# Altium project EFR32xG22_ESL-Node_Ref-Des.PrjPcb
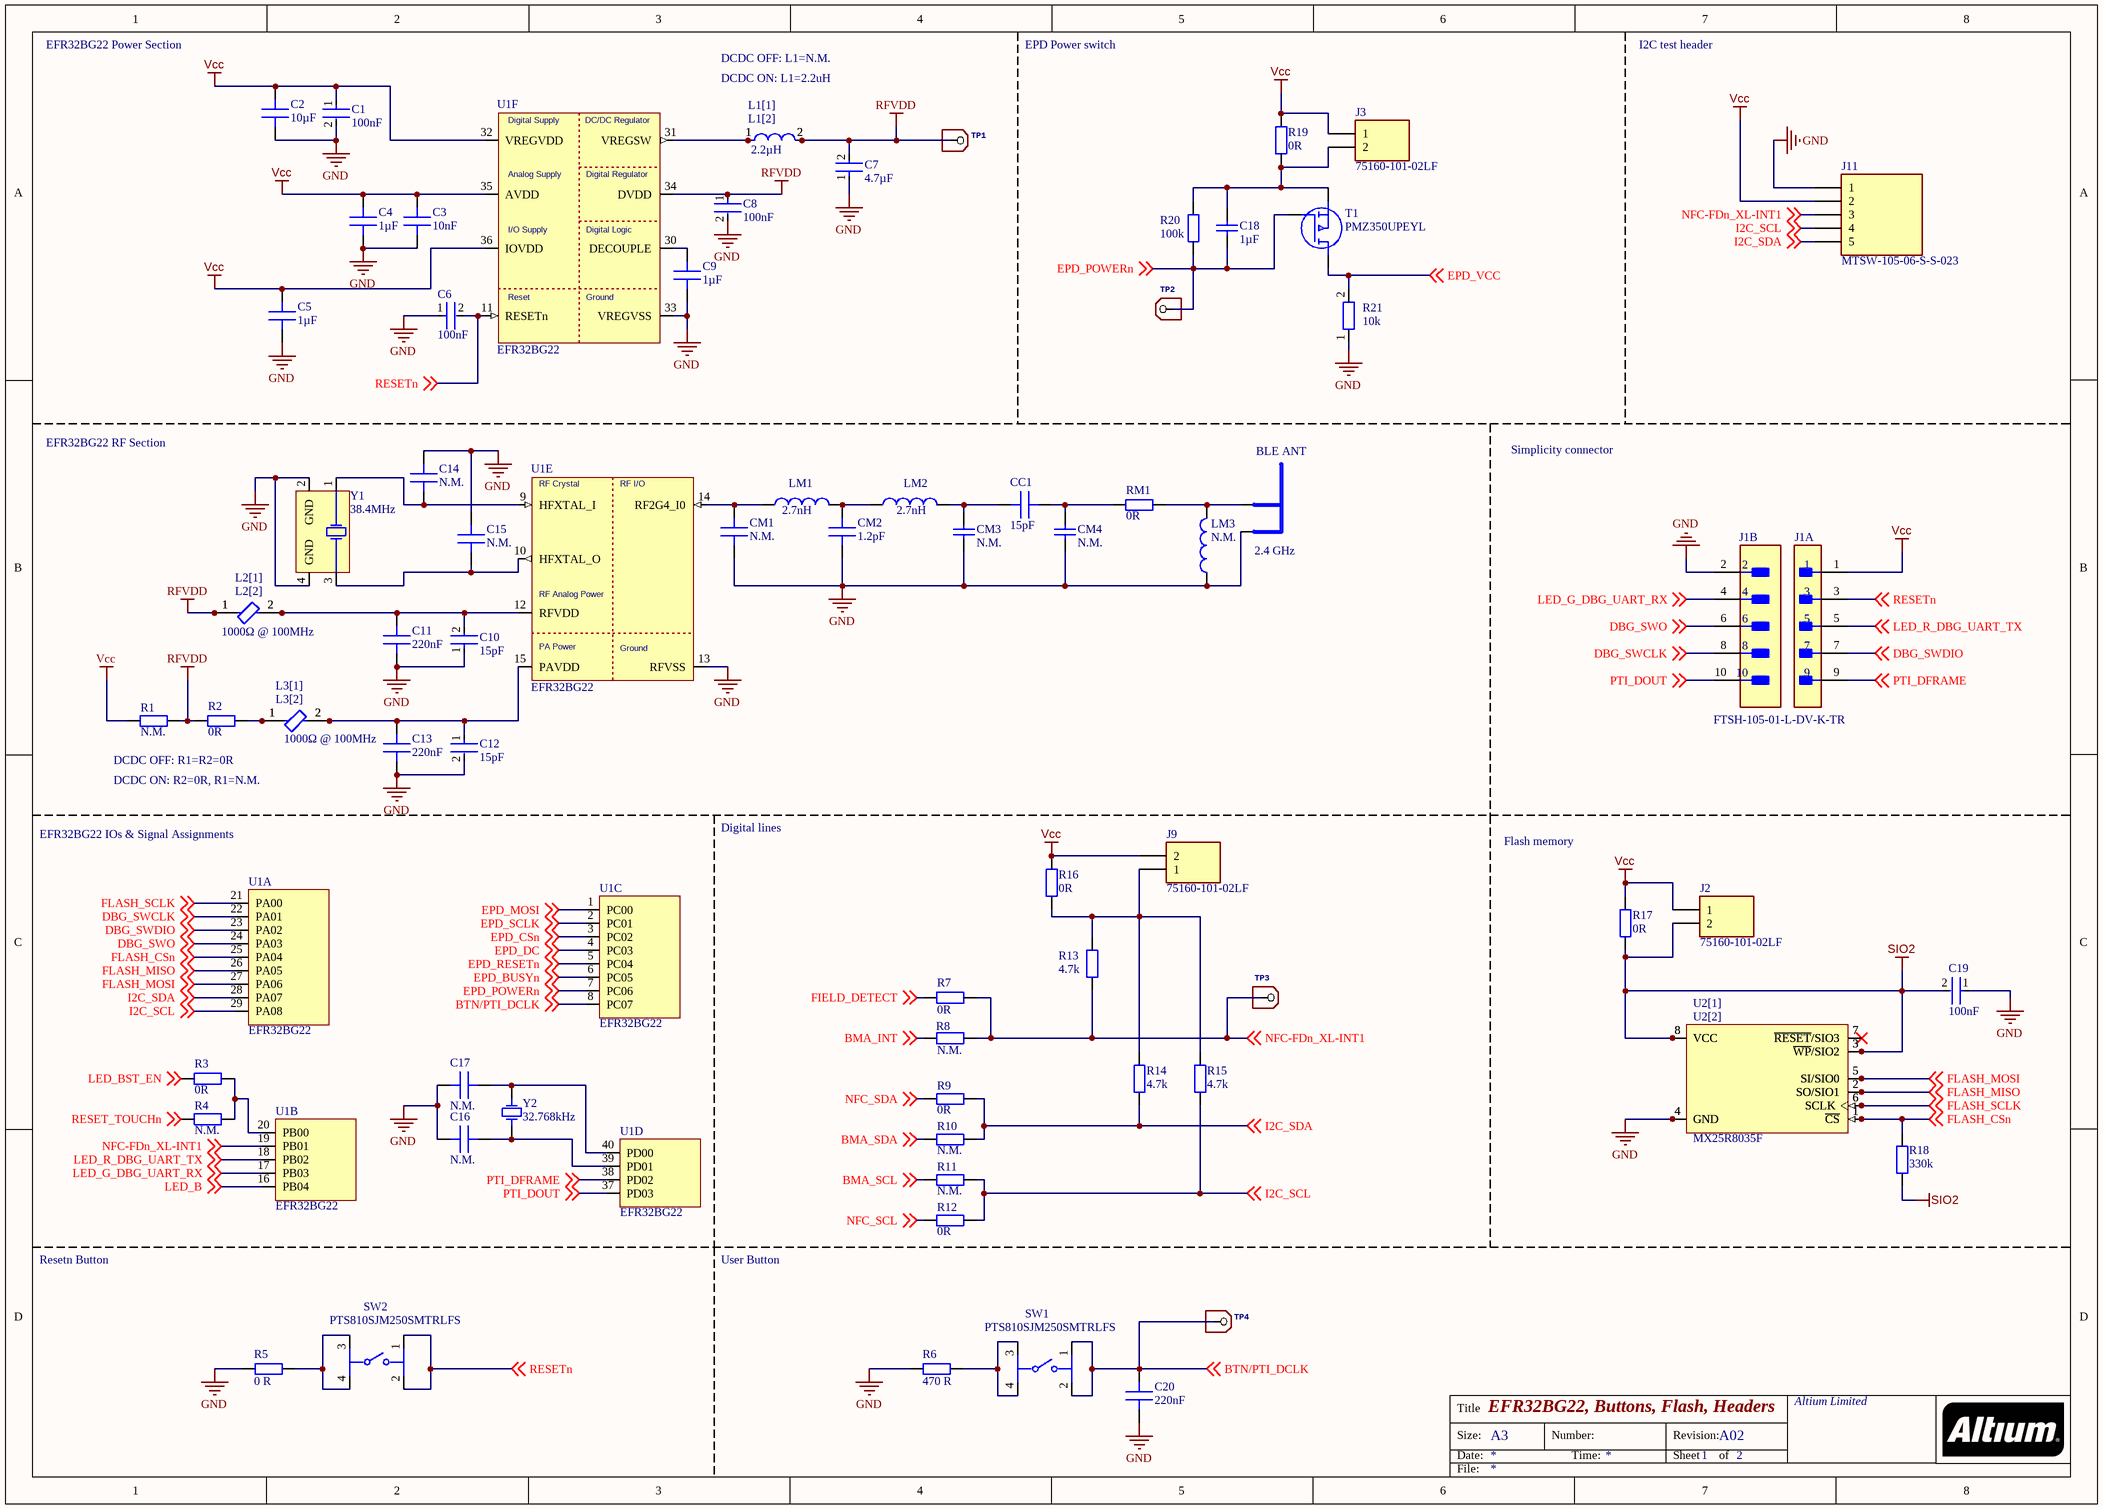
[diagram p0: EFR32xG22_ESL-Node_Ref-Des_Sheet1.SchDoc]
2 sheets, 179 parts. Net scope: global (net labels, ports and power ports of the same name join across sheets).
Board file: EFR32xG22_ESL-Node_Ref-Des.PcbDoc
Sheets:
  EFR32xG22_ESL-Node_Ref-Des_Sheet1.SchDoc
  EFR32xG22_ESL-Node_Ref-Des_Sheet2.SchDoc

## Sheet EFR32xG22_ESL-Node_Ref-Des_Sheet1.SchDoc: EFR32BG22, Buttons, Flash, Headers
size A3; Organization: Altium Limited; Revision: A02; SheetNumber: 1; SheetTotal: 2

### Parts
BLE_ANT  2.4 GHz  [RF_ANTENNA_INVERTED_F]
C1  100nF  [0201]
C2  value 10µF  [0402]  (hidden comment: CAP CER 0402 X5R 10uF 10V 20%)
C3  value 10nF  [0201]  (hidden comment: CAP CER 0201 X7R 10nF 10V 10%)
C4  value 1µF  [0402]  (hidden comment: CAP CER 0402 X7R 1uF 6.3V 10%)
C5  value 1µF  [0201]  (hidden comment: GRM033C81A105ME05D)
C6  100nF  [0201]
C7  4.7µF  [0402]
C8  100nF  [0201]
C9  value 1µF  [0201]  (hidden comment: GRM033C81A105ME05D)
C10  15pF  [0201]
C11  value 220nF  [0201]  (hidden comment: CAP CER 1000PF 10V X7R 0201 10%)
C12  15pF  [0201]
C13  value 220nF  [0201]  (hidden comment: CAP CER 1000PF 10V X7R 0201 10%)
C14  value N.M.  [0201]  (hidden comment: CAP CER 0201 C0G 1.2pF 50V 0.05pF)
C15  value N.M.  [0201]  (hidden comment: CAP CER 0201 C0G 1.2pF 50V 0.05pF)
C16  value N.M.  [0201]  (hidden comment: CAP CER 0201 C0G 1.2pF 50V 0.05pF)
C17  value N.M.  [0201]  (hidden comment: CAP CER 0201 C0G 1.2pF 50V 0.05pF)
C18  1µF  [0402]
C19  100nF  [0201]
C20  value 220nF  [0201]  (hidden comment: CAP CER 1000PF 10V X7R 0201 10%)
CC1  value 15pF  [0201_300ER]  (hidden comment: CAP CER 0201 NP0 18pF 25V 2%)
CM1  value N.M.  [0201_300ER]  (hidden comment: CAP CER 0201 C0G 1.2pF 50V 0.05pF)
CM2  value 1.2pF  [0201_300ER]  (hidden comment: CAP CER 0201 C0G 1.3pF 25V 0.05pF)
CM3  N.M.  [0201_300ER]
CM4  N.M.  [0201_300ER]
J1  FTSH-105-01-L-DV-K-TR  [FTSH_105_01_L_DV_K]  (value not drawn)  (parts A,B of 2)
J2  75160-101-02LF  [Jumper_HDR_2.54mm]
J3  75160-101-02LF  [Jumper_HDR_2.54mm]
J9  75160-101-02LF  [Jumper_HDR_2.54mm]
J11  MTSW-105-06-S-S-023  [Jumper_HDR_2.54mm_5p]
L1[1]  2.2µH  [0805]  (value not drawn)
L1[2]  2.2µH  [0603]
L2[1]  1000Ω @ 100MHz  [0402]
L2[2]  1000Ω @ 100MHz  [0603]  (value not drawn)
L3[1]  1000Ω @ 100MHz  [0402]
L3[2]  1000Ω @ 100MHz  [0603]  (value not drawn)
LM1  value 2.7nH  [0201_300ER]  (hidden comment: LQP03HQ2N6B02)
LM2  value 2.7nH  [0201_300ER]  (hidden comment: IND Fixed 0201 1.5nH 1A 50mOhm 0.05nH)
LM3  value N.M.  [0201_300ER]  (hidden comment: IND Fixed 0201 1.5nH 1A 50mOhm 0.05nH)
R1  N.M.  [0201]
R2  0R  [0201]
R3  0R  [0603]
R4  N.M.  [0603]
R5  value 0 R  [0201]  (hidden comment: RES 0201 100R 1/20W 1% 200ppm)
R6  value 470 R  [0201]  (hidden comment: RES 0201 100R 1/20W 1% 200ppm)
R7  0R  [0402]
R8  N.M.  [0402]
R9  0R  [0402]
R10  N.M.  [0402]
R11  N.M.  [0402]
R12  0R  [0402]
R13  4.7k  [0201]
R14  4.7k  [0201]
R15  4.7k  [0201]
R16  0R  [0603]
R17  0R  [0603]
R18  value 330k  [0201]  (hidden comment: RES 0201 330K 1/20W 1%)
R19  0R  [0603]
R20  100k  [0201]
R21  10k  [0201]
RM1  0R  [0201]
SW1  PTS810SJM250SMTRLFS  [SW_CK_PTS810]
SW2  PTS810SJM250SMTRLFS  [SW_CK_PTS810]
T1  PMZ350UPEYL  [SOT883_B_FIXED]
TP1  TPSMDR1  [TP_RPAD1]  (value not drawn)
TP2  TPSMDR1  [TP_RPAD1]  (value not drawn)
TP3  TPSMDR1  [TP_RPAD1]  (value not drawn)
TP4  TPSMDR1  [TP_RPAD1]  (value not drawn)
U1  value EFR32BG22  [QFN-40_EFR32]  (hidden comment: EFR32XG22)  (parts A,B,C,D,E,F of 6)
U2[1]  value MX25R8035F  [SOP8_127P600X175-8N_150mil]  (hidden comment: MX25R8035FZUIL0)
U2[2]  MX25R8035FZUIL0  [SOP8_127P790X216-8N_200mil]  (value not drawn)
Y1  value 38.4MHz  [XTAL_DSX211SH_4]  (hidden comment: DSX211SH 1ZZNAE38400AB0A)
Y2  value 32.768kHz  [XTAL_DST1610A]  (hidden comment: CM8V-T1A-32.768KHZ-7PF-20PPM-TA-QC)

### Nets
GND: BLE_ANT.2(GND) C1.2 C2.1 C3.2 C4.1 C5.2 C6.1 C7.1 C8.2 C9.1 C10.1 C11.2 C12.2 C13.2 C14.2 C15.2 C16.2 C17.2 C19.1 C20.2 CM1.2 CM2.2 CM3.2 CM4.2 J1.2 J11.1 LM3.1 R5.2 R6.2 R21.1 U1.13(RFVSS) U1.33(VREGVSS) U2[1].4(GND) U2[2].4(GND) Y1.2(GND) Y1.4(GND)
RFVDD: C7.2 C8.1 L1[1].2 L1[2].2 L2[1].1 L2[2].1 R1.1 R2.1 TP1.P$1 U1.34(DVDD)
SIO2: C19.2 J2.2 R17.1 R18.2 U2[1].3(~{WP}/SIO2) U2[1].8(VCC) U2[2].3(~{WP}/SIO2) U2[2].8(VCC)
Vcc: C1.1 C2.2 C3.1 C4.2 C5.1 J1.1 J2.1 J3.1 J9.2 J11.2 R1.2 R16.2 R17.2 R19.2 U1.32(VREGVDD) U1.35(AVDD) U1.36(IOVDD)
BMA_INT: R8.1 ; off-sheet BMA_INT
BMA_SCL: R11.2 ; off-sheet BMA_SCL
BMA_SDA: R10.2 ; off-sheet BMA_SDA
BTN/PTI_DCLK: C20.1 SW1.1 SW1.2 TP4.P$1 U1.8(PC07) ; off-sheet BTN/PTI_DCLK
DBG_SWCLK: J1.8 U1.22(PA01) ; off-sheet DBG_SWCLK
DBG_SWDIO: J1.7 U1.23(PA02) ; off-sheet DBG_SWDIO
DBG_SWO: J1.6 U1.24(PA03) ; off-sheet DBG_SWO
EPD_BUSYn: U1.6(PC05) ; off-sheet EPD_BUSYn
EPD_CSn: U1.3(PC02) ; off-sheet EPD_CSn
EPD_DC: U1.4(PC03) ; off-sheet EPD_DC
EPD_MOSI: U1.1(PC00) ; off-sheet EPD_MOSI
EPD_POWERn: C18.2 R20.1 T1.G TP2.P$1 U1.7(PC06) ; off-sheet EPD_POWERn
EPD_RESETn: U1.5(PC04) ; off-sheet EPD_RESETn
EPD_SCLK: U1.2(PC01) ; off-sheet EPD_SCLK
EPD_VCC: R21.2 T1.D ; off-sheet EPD_VCC
FIELD_DETECT: R7.2 ; off-sheet FIELD_DETECT
FLASH_CSn: R18.1 U1.25(PA04) U2[1].1(~{CS}) U2[2].1(~{CS}) ; off-sheet FLASH_CSn
FLASH_MISO: U1.26(PA05) U2[1].2(SO/SIO1) U2[2].2(SO/SIO1) ; off-sheet FLASH_MISO
FLASH_MOSI: U1.27(PA06) U2[1].5(SI/SIO0) U2[2].5(SI/SIO0) ; off-sheet FLASH_MOSI
FLASH_SCLK: U1.21(PA00) U2[1].6(SCLK) U2[2].6(SCLK) ; off-sheet FLASH_SCLK
I2C_SCL: J11.4 R11.1 R12.1 R15.1 U1.29(PA08) ; off-sheet I2C_SCL
I2C_SDA: J11.5 R9.1 R10.1 R14.1 U1.28(PA07) ; off-sheet I2C_SDA
LED_B: U1.16(PB04) ; off-sheet LED_B
LED_BST_EN: R3.1 ; off-sheet LED_BST_EN
LED_G_DBG_UART_RX: J1.4 U1.17(PB03) ; off-sheet LED_G_DBG_UART_RX
LED_R_DBG_UART_TX: J1.5 U1.18(PB02) ; off-sheet LED_R_DBG_UART_TX
NFC-FDn_XL-INT1: J11.3 R7.1 R8.2 R13.1 TP3.P$1 U1.19(PB01) ; off-sheet NFC-FDn_XL-INT1
NFC_SCL: R12.2 ; off-sheet NFC_SCL
NFC_SDA: R9.2 ; off-sheet NFC_SDA
PTI_DFRAME: J1.9 U1.38(PD02) ; off-sheet PTI_DFRAME
PTI_DOUT: J1.10 U1.37(PD03) ; off-sheet PTI_DOUT
RESET_TOUCHn: R4.2 ; off-sheet RESET_TOUCHn
RESETn: C6.2 J1.3 SW2.1 SW2.2 U1.11(RESETn) ; off-sheet RESETn
NetBLE_ANT_1: BLE_ANT.1(ANT) LM3.2 RM1.2
NetC9_2: C9.2 U1.30(DECOUPLE)
NetC10_2: C10.2 C11.1 L2[1].2 L2[2].2 U1.12(RFVDD)
NetC12_1: C12.1 C13.1 L3[1].2 L3[2].2 U1.15(PAVDD)
NetC14_1: C14.1 U1.9(HFXTAL_I) Y1.1(X1)
NetC15_1: C15.1 U1.10(HFXTAL_O) Y1.3(X2)
NetC16_1: C16.1 U1.39(PD01) Y2.1
NetC17_1: C17.1 U1.40(PD00) Y2.2
NetC18_1: C18.1 J3.2 R19.1 R20.2 T1.S
NetCC1_1: CC1.1 CM3.1 LM2.2
NetCC1_2: CC1.2 CM4.1 RM1.1
NetCM1_1: CM1.1 LM1.1 U1.14(RF2G4_I0)
NetCM2_1: CM2.1 LM1.2 LM2.1
NetJ9_1: J9.1 R13.2 R14.2 R15.2 R16.1
NetL1[1]_1: L1[1].1 L1[2].1 U1.31(VREGSW)
NetL3[1]_1: L3[1].1 L3[2].1 R2.2
NetR3_2: R3.2 R4.1 U1.20(PB00)
NetR5_1: R5.1 SW2.3 SW2.4
NetR6_1: R6.1 SW1.3 SW1.4
NetU2[1]_7: U2[1].7(~{RESET}/SIO3) U2[2].7(~{RESET}/SIO3)

### Notes on the sheet
- EFR32BG22 Power Section
- EPD Power switch
- I2C test header
- DCDC OFF: L1=N.M.
- DCDC ON: L1=2.2uH
- EFR32BG22 RF Section
- Simplicity connector
- DCDC OFF: R1=R2=0R
- DCDC ON: R2=0R, R1=N.M.
- EFR32BG22 IOs & Signal Assignments
- Digital lines
- Flash memory
- Resetn Button
- User Button
- Title
- Size:
- Date:
- A3
- Number:
- Time:
- Revision:
- Sheet
- of
- File:
- (in symbol EFR32XG22, part E) RF Crystal; RF I/O; RF Analog Power; PA Power; Ground
- (in symbol EFR32XG22, part F) Digital Supply; DC/DC Regulator; Analog Supply; Digital Regulator; I/O Supply; Digital Logic; Reset; Ground

### Library data of the parts
BLE_ANT = ANT_INVERTED_F: PCB Footprint: EM358x_INVERTED_F
C1 C6 C8 C19 = CMP-06035-000062-2: Chip Multilayer Ceramic Capacitors for General Purpose, 0201, 0.10uF, X5R, 15%, 10%, 6.3V; Min Operating Temperature: -55°C; Lead Free: Lead Free; Radiation Hardening: No; Dielectric: X5R; Voltage Rating (DC): 6.3V; REACH SVHC: No SVHC; Case/Package: 0201; Voltage Rating: 6.3V; Length: 0.6mm; Max Operating Temperature: 85°C; Width: 0.012inch; Depth: 0.3mm; Material: Ceramic; Case Code (Metric): 0603; Thickness: 0.013inch; Packaging: Tape and Reel; Height: 0.3mm; Capacitance: 100nF; Weight: 6E-06oz; Package Quantity: 1; Mount: Surface Mount; Voltage: 6.3V; Case Code (Imperial): 0201; Tolerance: 10%; Termination: SMD/SMT
C2 = CMP-120-00104-A.01: SubCategory Tag: Ceramic; RoHS: Compliant; Material: X5R; Mount: SMD; Rating: 10V; Package: 0402; Tolerance: 20%; Max Operating Temp: 85°C; Min Operating Temp: -55°C
C3 = CMP-120-00000-A.11: SubCategory Tag: Ceramic; Rating: 10V; Tolerance: 10%; Min Operating Temp: -55°C; RoHS: Compliant; Max Operating Temp: 85°C; Material: X7R; Package: 0201; Mount: SMD
C4 = CMP-120-00029-A.01: SubCategory Tag: Ceramic; Material: X7R; Min Operating Temp: -55°C; Package: 0402; Rating: 6.3V; Mount: SMD; Tolerance: 10%; RoHS: Compliant; Max Operating Temp: 125°C
C5 C9 = CMP-120-00040-A.03: CAP CER 0201 X6S 1uF 10V 20%; Manufacturer: Murata; SubCategory Tag: Ceramic; Min Operating Temp: -55°C; Rating: 10V; Package: 0201; Manufacturer PN: GRM033C81A105ME05D; Max Operating Temp: 105°C; Tolerance: 20%; Material: X6S; Mount: SMD; RoHS: Compliant
C7 = CMP-2008-04549-2: Chip Multilayer Ceramic Capacitors for General Purpose, 0402, 4.7uF, X5R, 15%, 20%, 6.3V; Height: 0.5mm; Weight: 0.000212oz; Length: 1mm; Case Code (Metric): 1005; Packaging: Tape and Reel; Termination: SMD/SMT; Dielectric: X5R; Depth: 0.5mm; Case Code (Imperial): 0402; Min Operating Temperature: -55°C; Case/Package: 0402; Voltage: 6.3V; Width: 0.02inch; Capacitance: 4.7uF; Lead Free: Lead Free; Thickness: 0.022inch; Contact Plating: Tin; REACH SVHC: No SVHC; Package Quantity: 10000; Tolerance: 20%; Voltage Rating (DC): 6.3V; Voltage Rating: 6.3V; Mount: Surface Mount; Max Operating Temperature: 85°C
C10 C12 = CMP-2010-01505-2: Chip Multilayer Ceramic Capacitors for General Purpose, 0201, 15pF, C0G, 30ppm/°C, 5%, 50V; Voltage: 50V; Lead Free: Lead Free; Package Quantity: 1; Length: 0.6mm; Max Operating Temperature: 125°C; Height: 0.3mm; Tolerance: 5%; Termination: SMD/SMT; Case Code (Metric): 0603; Voltage Rating (DC): 50V; Radiation Hardening: No; Mount: Surface Mount; Case Code (Imperial): 0201; Thickness: 0.013inch; Case/Package: 0201; REACH SVHC: No SVHC; Width: 0.012inch; Dielectric: C0G; Min Operating Temperature: -55°C; Packaging: Tape and Reel; Capacitance: 15pF; Depth: 0.3mm; Voltage Rating: 50V
C11 C13 C20 = CMP-120-00038-A.01: SubCategory Tag: Ceramic; Min Operating Temp: -55°C; RoHS: Compliant; Mount: SMD; Rating: 10V; Tolerance: 10%; Package: 0201; Material: X7R; Max Operating Temp: 125°C
C14-C17 CM1 = CMP-120-00031-A.02: SubCategory Tag: Ceramic; Min Operating Temp: -55°C; Package: 0201; Mount: SMD; Max Operating Temp: 125°C; Rating: 50V; RoHS: Compliant; Material: C0G; Tolerance: 0.05pF
C18 = CMP-2000-06336-1: Chip Capacitor, 1 uF, +/- 10%, 10 V, -55 to 85 degC, 0603 (1608 Metric), RoHS, Tape and Reel; Manufacturer: Murata; Dielectric: X5R; Voltage Rating: 10V; Case Height: 0.8mm; Temperature Coefficient / Code: +/-15%; Type: GeneralPurposeMLCC; Brand: MurataElectronics; Capacitance: 1uF; Case Length: 1.6mm; Capacitance - nF: 1000nF; Package Description: 2-Pin Surface Mount Device, Body 1.6 x 0.8 mm; Maximum Operating Temperature: +85C; Minimum Operating Temperature: -55C; Mounting Technology: SurfaceMount; RoHS: Details; Package Reference: 0603; Product: GeneralTypeMLCCs; Packaging: Reel; Case Code - mm: 1608; Manufacturer URL: http://www.murata.com/; Dimensions: 0.8mmWx1.6mmLx0.8mmH; Factory Pack Quantity: 4000; Case Code - in: 0603; Tolerance: 10%; Product Category: MultilayerCeramicCapacitorsMLCC-SMD/SMT; Series: GRM; Datasheet Version: 02/2016; Case Width: 0.8mm; Operating Temperature Range: -55Cto+85C; Datasheet URL: http://search.murata.co.jp/Ceramy/image/img/A01X/G101/ENG/GRM188R61A105KA61-01.pdf; Package / Case: 0603(1608metric); Termination Style: SMD/SMT; Voltage Rating DC: 10V
CC1 = CMP-120-00037-A.02: SubCategory Tag: Ceramic; Mount: SMD; RoHS: Compliant; Tolerance: 2%; Rating: 25V; Min Operating Temp: -55°C; Max Operating Temp: 125°C; Package: 0201; Material: COG
CM2 = CMP-120-00033-A.02: SubCategory Tag: Ceramic; Tolerance: 0.05pF; Material: C0G; Mount: SMD; Max Operating Temp: 125°C; Min Operating Temp: -55°C; Package: 0201; RoHS: Compliant; Rating: 25V
CM3 CM4 = CMP-1033-00061-2: Part Number: 02013A1R5CAT2A; Manufacturer: AVX Interconnect / Elco
J1 = CMP-2000-06293-2: CONN HEADER SMD 10POS 1.27MM; Max Current Rating: 1.75A; Number of Contacts: 10; Gender: Male; Row Spacing: 0.05inch; Connector Type: Male Pin; Housing Color: Black; Min Operating Temperature: -55°C; Depth: 3.43mm; Color: Black; Contact Plating: Gold; REACH SVHC: No SVHC; Packaging: Tape and Reel; Current Rating: 1.75A; Radiation Hardening: No; Package Quantity: 550; Number of Positions: 10; Max Operating Temperature: 125°C; Orientation: Straight; Termination: Solder; Contact Mating Length: 0.12inch; Number of Rows: 2; Lead Free: Lead Free; Contact Material: Bronze; Mount: Surface Mount; Housing Material: Polymer; Pitch: 1.27mm; Length: 6.35mm
J2 J3 J9 = HTSW-102-28-F-S: HEADER, 2.54MM, VERTICAL THOUGH HOLE, 2 POSITION; Connector Systems:Board-to-Board; Pitch Spacing:2.54mm; No. of Rows:1Rows; No. of Contacts:2Contacts; Contact Termination Type:Through Hole; Product Range:HTSW Series; Gender:Header RoHS Compliant: Yes; MP: HTSW10228FS; MF: Samtec; Package: None; Price: None; Purchase-URL: https://pricing.snapeda.com/search/part/HTSW10228FS/?ref=eda; Availability: In Stock; Value: *; Check_prices: https://www.snapeda.com/parts/HTSW10228FS/Samtec/view-part/?ref=eda; SnapEDA_Link: https://www.snapeda.com/parts/HTSW10228FS/Samtec/view-part/?ref=snap
L1[1] L1[2] = CMP-06042-016317-1: Multilayer Type Inductor for Power Lines, 0805 (2012), 2.2μH, 30%, 0.288Ω, 0.8A; Test Frequency: 1MHz; Shielding: Shielded; Current Rating: 800mA; Self Resonant Frequency: 40MHz; Core Material: Ferrite; Inductance: 2.2uH; DC Resistance (DCR): 288mR; RoHS Compliant: Yes; REACH SVHC: No SVHC; Inductance Tolerance: 30%; Package Quantity: 4000; Military Standard: Not; Max Operating Temperature: 125°C; Radiation Hardening: No; Series: LQM; Height - Seated (Max): 0.039inch; Tolerance: 30%; Height: 0.9mm; Lead Free: Lead Free; Case Code (Metric): 2012; Packaging: Tape and Reel; Termination: SMD/SMT; Case Code (Imperial): 0805; Min Operating Temperature: -55°C; Depth: 1.4mm; Mount: Surface Mount; Length: 2mm; DC Current: 800mA; Case/Package: 0805; Max DC Current: 800mA; Width: 0.049inch
L2[1] L2[2] L3[1] L3[2] = CMP-0686-00457-3: Chip Ferrite Bead, 0603, 1000Ω @ 100MHz, 0.5Ω, 25%, 450mA; Number of Circuits: 1; Max DC Current: 400mA; Shielding: Unshielded; DC Resistance (DCR): 500mR; Material: Steel; DC Resistance-Max: 700mR; Impedance: 1kR; Case Code (Imperial): 0603; Max Current Rating: 400mA; Frequency: 100MHz; Min Operating Temperature: -55°C; Case/Package: 0603; Depth: 0.8mm; Lead Free: Lead Free; Core Material: Ferrite; Current Rating: 400mA; Resistance: 500mR; Case Code (Metric): 1608; DC Current: 400mA; Package Quantity: 1; Packaging: Tape and Reel; Width: 0.8mm; Military Standard: Not; Height: 0.8mm; Series: BLM18A; Max Operating Temperature: 125°C; Tolerance: 25%; Termination: SMD/SMT; Test Frequency: 100MHz; Number of Lines: 1; Number of Pins: 2; REACH SVHC: No SVHC; Length: 1.6mm; Radiation Hardening: No
LM1 = CMP-155-00023-A.03: IND FIXED 0201 2.6nH 600mA 0.12Ohm ±0.1nH; Manufacturer: Murata; DC Resistance: 0.12; Shielding: Not shielded; RoHS: Compliant; Tolerance: 0.1nH; SubCategory Tag: Fixed; Manufacturer PN: LQP03HQ2N6B02; Max Operating Temp: 125°C; Rating: 600mA; Package: 0201; Mount: SMD; Min Operating Temp: -55°C
LM2 LM3 = CMP-155-00007-A.02: Shielding: Not shielded; DC Resistance: 50m; Rating: 1A; Tolerance: 0.05nH; Min Operating Temp: -55°C; RoHS: Compliant; Max Operating Temp: 125°C; Package: 0201; Mount: SMD; SubCategory Tag: Fixed
R1-R4 R16 R17 R19 RM1 = CMP-1012-00001-2: Manufacturer: Vishay Dale; Part Number: CRCW06030000Z0EC
R5 R6 = CMP-180-00121-A.01: Rating: 50mW; SubCategory Tag: Thick Film; Package: 0201; Mount: SMD; Min Operating Temp: -55°C; Max Operating Temp: 155°C; RoHS: Compliant; Tolerance: 1%
R7-R12 = CMP-2002-08060-1: Manufacturer: Yageo / Phycomp; Part Number: RC0402JR-130RL
R13-R15 = CMP-1010-00090-1: 4K7 0.05W 5% 0201 (0603 Metric)  SMD; Value: 4700.00 Ohm; Case-Metric: 0603; Technology: SMT; Case-EIA: 0201; Power: 0.05 W; Tolerance: 5 %
R18 = CMP-180-00036-A.02: Rating: 50mW; SubCategory Tag: Thick Film; Mount: SMD; Max Operating Temp: 155°C; Package: 0201; Min Operating Temp: -55°C; RoHS: Compliant; Tolerance: 1%
R20 = CMP-1010-00642-1: 100K 0.05W 1% 0201 (0603 Metric)  SMD; Value: 100000.00 Ohm; Case-Metric: 0603; Technology: SMT; Power: 0.05 W; Case-EIA: 0201; Tolerance: 1 %
R21 = CMP-03412-037826-1: RES SMD 10K OHM 5% 1/20W 0201; Voltage Rating: 25V; Max Power Dissipation: 50mW; Temperature Coefficient: 200ppm/°C; Resistance: 10kR; Min Operating Temperature: -55°C; Packaging: Tape and Reel; Tolerance: 5%; Length: 0.6mm; Contact Plating: Tin; Features: Moisture Resistant; Radiation Hardening: No; Military Standard: Not; Voltage Rating (DC): 25V; Termination: SMD/SMT; Size Code: 0201; Resistance Tolerance: 5%; Case Code (Imperial): 0201; Resistor Type: Thick Film; Depth: 0.3mm; Series: RC; Lead Free: Lead Free; Power Rating: 50mW; Number of Terminations: 2; Case Code (Metric): 0603; RoHS Compliant: Yes; Max Operating Temperature: 125°C; Construction: Rectangular; Case/Package: 0201
SW1 SW2 = CMP-10040-000001-2: SWITCH TACTILE SPST-NO 0.05A 16V; Throw Configuration: SPST; Operating Force: 160gf; Actuator Type: Standard; Switch Travel: 0.15mm; Switch Function: Off-Mom; Max Current Rating: 50mA; Mechanical Life: 150000Cycles; Illumination Type: Non-Illuminated; Package Quantity: 2900; Depth: 4.6mm; Mount: Surface Mount; Packaging: Tape and Reel; Length: 3.2mm; RoHS Compliant: Yes; Case/Package: SMD/SMT; Voltage Rating (DC): 16V; Min Operating Temperature: -40°C; Termination: J-Bend; Lead Free: Lead Free; Contact Plating: Silver; Orientation: Straight; Max Operating Temperature: 85°C; Current Rating: 50mA; Color: Black
T1 = PMZ350UPEYL: P-Channel 20V 1A (Ta) 360mW (Ta), 3.125W (Tc) Surface Mount DFN1006-3; MF: Nexperia USA; Availability: In Stock; Price: None; Package: DFN1006-3-3 Nexperia; MP: PMZ350UPEYL; Value: *; SnapEDA_Link: https://www.snapeda.com/parts/PMZ350UPEYL/Nexperia/view-part/?ref=snap; Check_prices: https://www.snapeda.com/parts/PMZ350UPEYL/Nexperia/view-part/?ref=eda; Purchase-URL: https://pricing.snapeda.com/search/part/PMZ350UPEYL/?ref=eda
TP1-TP4 = TPSMDR1: Testpoint
U1 = EFR32XG22: IC RF SoC 2G4+SUBG 32bit 1024kB FLASH QFN40; Manufacturer: Silicon Labs; SubCategory Tag: Embedded; Voltage: 3.8V; Additional Search Tag: SoC Wireless; Mount: SMD; Min Operating Temp: 125°C; RoHS: Compliant; Max Operating Temp: -40°C; Manufacturer PN: EFR32XG22; Package: QFN40
U2[1] U2[2] = CMP-150-00010-A.07: IC FLASH 8MBIT SPI/QUAD USON; Manufacturer: Macronix; SubCategory Tag: Memory; Voltage: 3.6V; Manufacturer PN: MX25R8035FZUIL0; Package: 8-USON; Additional Search Tag: Flash; RoHS: Compliant; Max Operating Temp: 85°C; Mount: SMD; Min Operating Temp: -40°C
  U2[2]: Value: MX25R8035F
Y1 = XTAL-1-3-4P: CRYSTAL 2.0X1.6mm 38.4MHz 10pF 20ppm; Manufacturer: KDS; SubCategory Tag: XTAL; Tolerance: 20ppm; Max Operating Temp: 105°C; Manufacturer PN: DSX211SH 1ZZNAE38400AB0A; RoHS: Compliant; Package: 2.0X1.6mm; Min Operating Temp: -40°C; Mount: SMD
Y2 = XTAL-2P: CRYSTAL 2.0x1.2mm 32.768kHz 7pF 20ppm; Manufacturer: Micro Crystal; SubCategory Tag: XTAL; RoHS: Compliant; Package: 2.0x1.2mm; Mount: SMD; Tolerance: 20ppm; Max Operating Temp: 85°C; Manufacturer PN: CM8V-T1A-32.768KHZ-7PF-20PPM-TA-QC; Min Operating Temp: -40°C
J11 = MTSW-105-06-S-S-023: Value: *; MP: MTSW-105-06-S-S-023; Availability: Unavailable; Price: None; Design Item ID: MTSW-105-06-S-S-023; Source: MTSW-105-06-S-S-023.SchLib; Package: None

## Sheet EFR32xG22_ESL-Node_Ref-Des_Sheet2.SchDoc: LED, NTAG, EPD, XM, Batteries
size A3; Organization: Altium Limited; Revision: A02; SheetNumber: 2; SheetTotal: 2
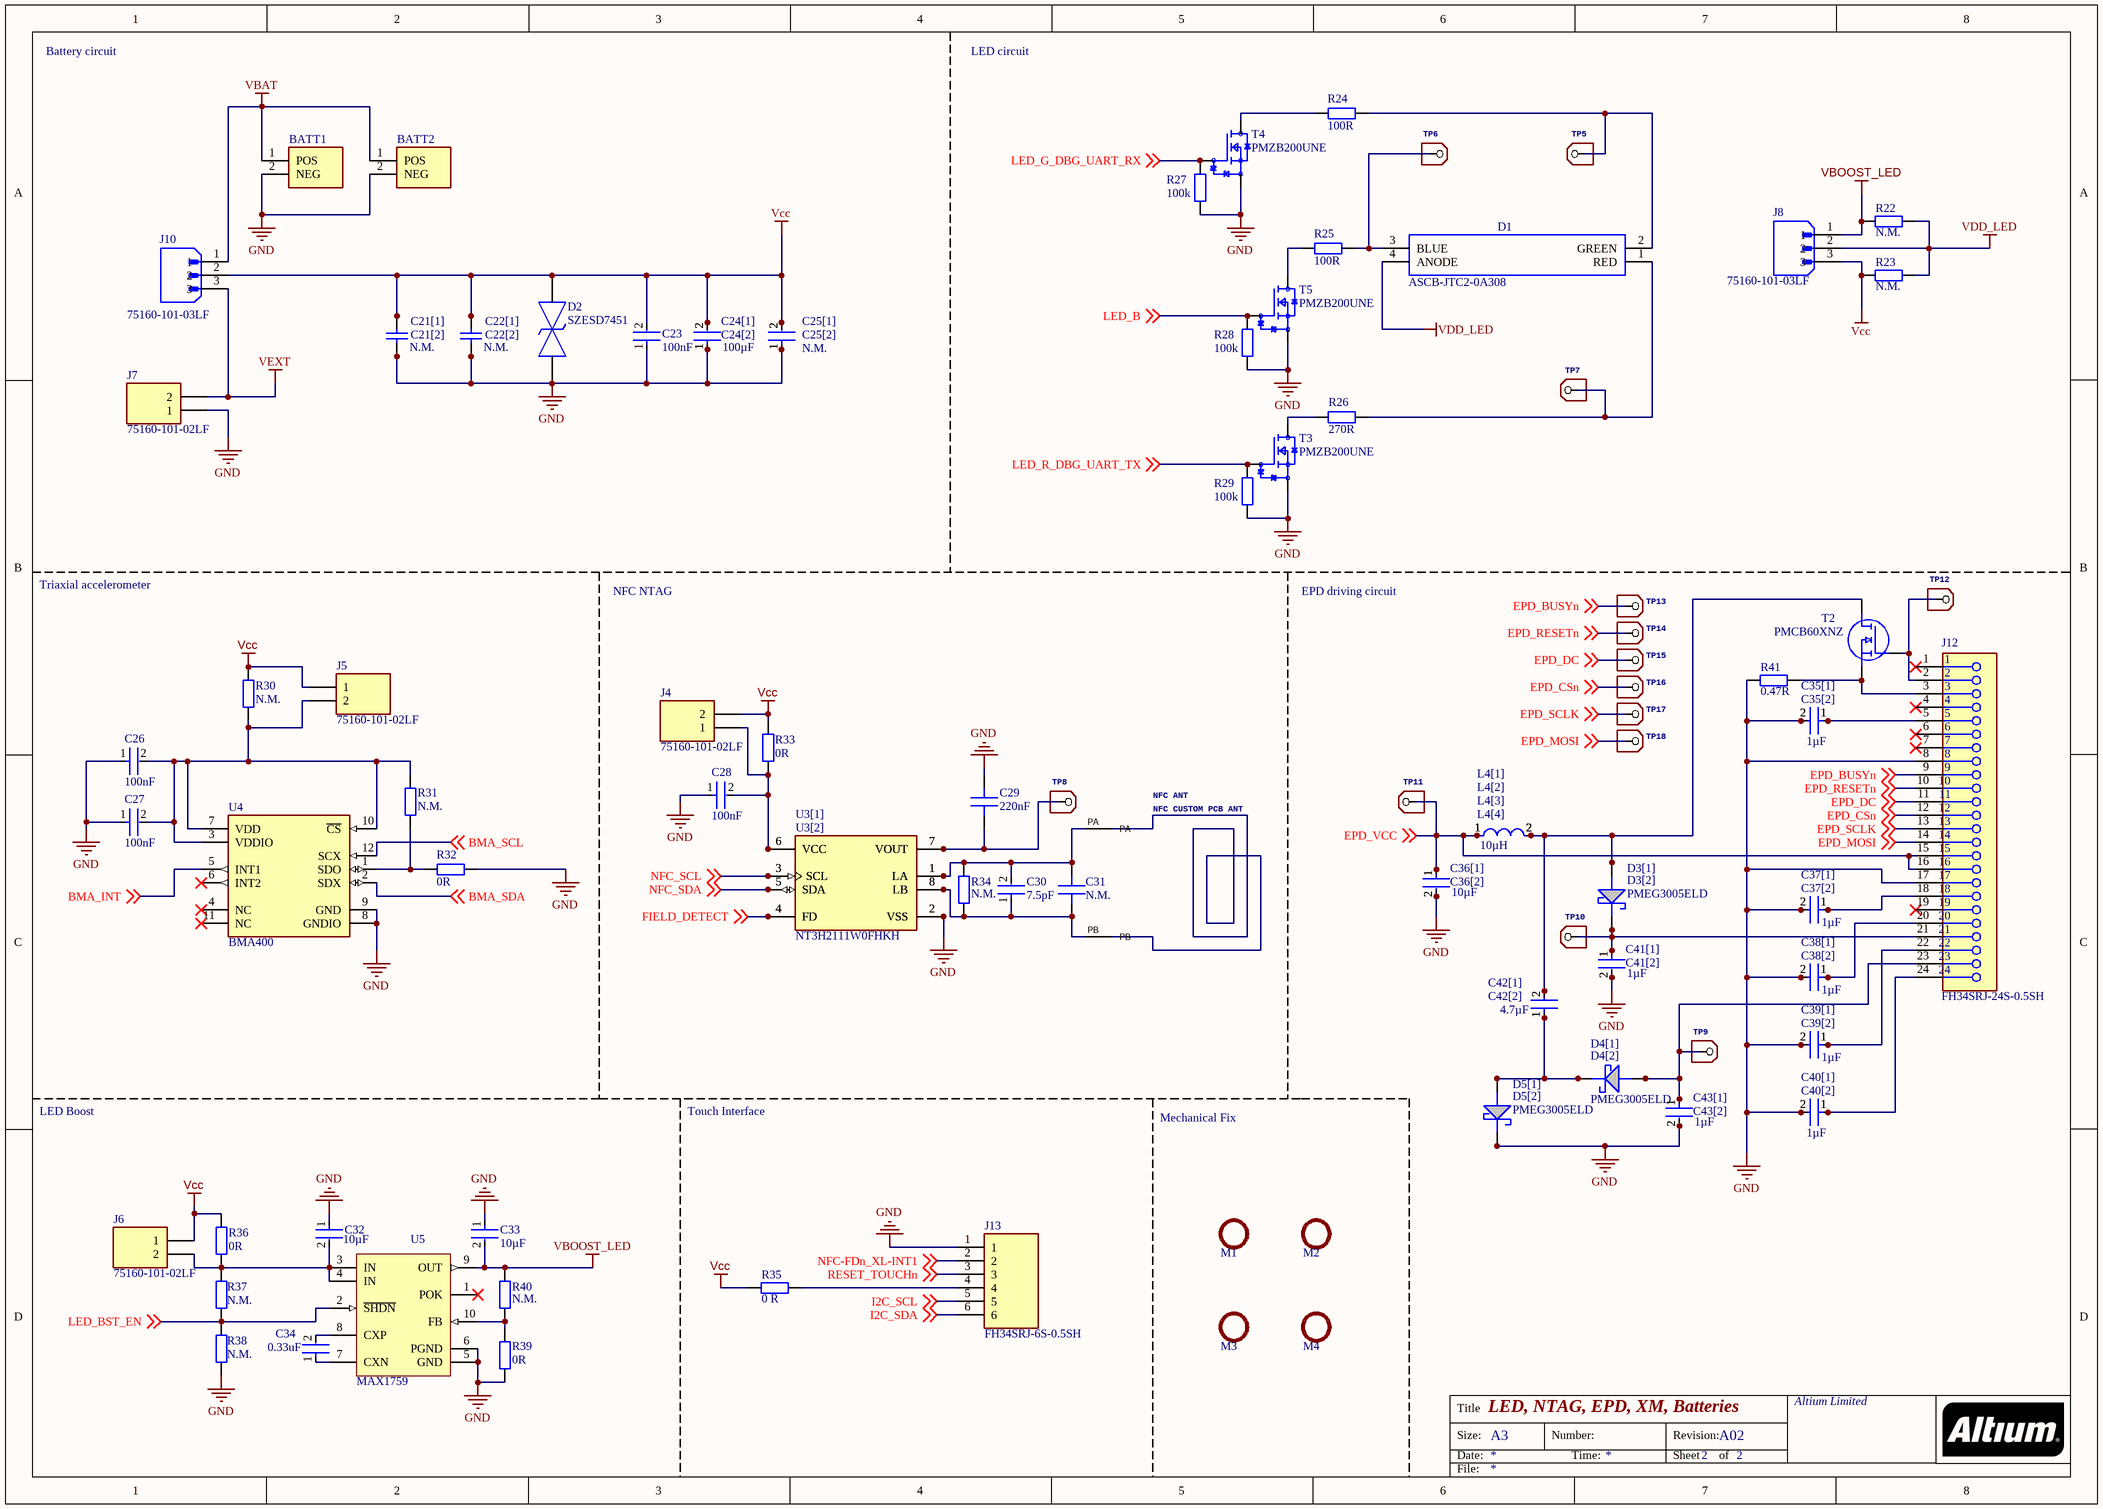
[diagram p1: EFR32xG22_ESL-Node_Ref-Des_Sheet2.SchDoc]

### Parts
BATT1  1052TR  [Battery_holder_CR2450_SMT_1052]  (value not drawn)
BATT2  1052TR  [Battery_holder_CR2450_SMT_1052]  (value not drawn)
C21[1]  N.M.  [1206]
C21[2]  N.M.  [0805]  (value not drawn)
C22[1]  N.M.  [1206]
C22[2]  N.M.  [0805]  (value not drawn)
C23  100nF  [0402]
C24[1]  100µF  [1206]
C24[2]  100µF  [0805]  (value not drawn)
C25[1]  N.M.  [1206]
C25[2]  100µF  [0805]  (value not drawn)
C26  100nF  [0402]
C27  100nF  [0402]
C28  100nF  [0201]
C29  value 220nF  [0201]  (hidden comment: CAP CER 1000PF 10V X7R 0201 10%)
C30  7.5pF  [0201]
C31  value N.M.  [0201]  (hidden comment: CAP CER 0201 C0G 1.2pF 50V 0.05pF)
C32  10µF  [0603]
C33  10µF  [0603]
C34  0.33uF  [0603]
C35[1]  1µF  [0603]
C35[2]  1µF  [0402]  (value not drawn)
C36[1]  10µF  [0603]
C36[2]  10µF  [0402]  (value not drawn)
C37[1]  1µF  [0603]
C37[2]  1µF  [0402]  (value not drawn)
C38[1]  1µF  [0603]
C38[2]  1µF  [0402]  (value not drawn)
C39[1]  1µF  [0603]
C39[2]  1µF  [0402]  (value not drawn)
C40[1]  1µF  [0603]
C40[2]  1µF  [0402]  (value not drawn)
C41[1]  1µF  [0603]
C41[2]  1µF  [0402]  (value not drawn)
C42[1]  4.7µF  [0603]
C42[2]  4.7µF  [0402]  (value not drawn)
C43[1]  1µF  [0603]
C43[2]  1µF  [0402]  (value not drawn)
D1  ASCB-JTC2-0A308  [LED_RGB_PLCC-4]
D2  SZESD7451  [SOD882_NXP]
D3[1]  PMEG3005ELD  [SOD-323]  (value not drawn)
D3[2]  PMEG3005ELD  [SOD882_FIXED]
D4[1]  PMEG3005ELD  [SOD-323]  (value not drawn)
D4[2]  PMEG3005ELD  [SOD882_FIXED]
D5[1]  PMEG3005ELD  [SOD-323]  (value not drawn)
D5[2]  PMEG3005ELD  [SOD882_FIXED]
J4  75160-101-02LF  [Jumper_HDR_2.54mm]
J5  75160-101-02LF  [Jumper_HDR_2.54mm]
J6  75160-101-02LF  [Jumper_HDR_2.54mm]
J7  75160-101-02LF  [Jumper_HDR_2.54mm]
J8  75160-101-03LF  [Jumper_HDR_2.54mm_3p]
J10  75160-101-03LF  [Jumper_HDR_2.54mm_3p]
J12  FH34SRJ-24S-0.5SH  [FPC_CONNECTOR_24_0.5MM_PITCH_BOTTOM_CONTACT_ACES_1.3MM_50530]
J13  FH34SRJ-6S-0.5SH  [FH34SRJ-6S-0.5SH]
L4[1]  10µH  [0805]  (value not drawn)
L4[2]  10µH  [0806]  (value not drawn)
L4[3]  10µH  [2520]  (value not drawn)
L4[4]  10µH  [WE-MAPI-3015]
M1  HOLE_2.2_NPL  [HOLE_2.2_NPL]  (value not drawn)
M2  HOLE_2.2_NPL  [HOLE_2.2_NPL]  (value not drawn)
M3  HOLE_2.2_NPL  [HOLE_2.2_NPL]  (value not drawn)
M4  HOLE_2.2_NPL  [HOLE_2.2_NPL]  (value not drawn)
NFC_ANT  NFC CUSTOM PCB ANT  [NFC_27X14.3_7W_WIDTH0.25MM_SPACE0.2MM_1.5UH_V1_0_NOVIASTOP]
R22  N.M.  [0603]
R23  N.M.  [0603]
R24  value 100R  [0201]  (hidden comment: RES 0201 100R 1/20W 1% 200ppm)
R25  value 100R  [0201]  (hidden comment: RES 0201 100R 1/20W 1% 200ppm)
R26  270R  [0201]
R27  100k  [0201]
R28  100k  [0201]
R29  100k  [0201]
R30  N.M.  [0603]
R31  value N.M.  [0201]  (hidden comment: RES 0201 0R)
R32  value 0R  [0201]  (hidden comment: RES 0201 0R)
R33  0R  [0603]
R34  value N.M.  [0201]  (hidden comment: RES 0201 0R)
R35  0 R  [0603]
R36  0R  [0603]
R37  N.M.  [0603]
R38  N.M.  [0603]
R39  value 0R  [0201]  (hidden comment: RES 0201 0R)
R40  value N.M.  [0201]  (hidden comment: RES 0201 0R)
R41  0.47R  [0402]
T2  PMCB60XNZ  [SOT8026]
T3  PMZB200UNE  [SOT883_B_FIXED]
T4  PMZB200UNE  [SOT883_B_FIXED]
T5  PMZB200UNE  [SOT883_B_FIXED]
TP5  TPSMDR1  [TP_RPAD1]  (value not drawn)
TP6  TPSMDR1  [TP_RPAD1]  (value not drawn)
TP7  TPSMDR1  [TP_RPAD1]  (value not drawn)
TP8  TPSMDR1  [TP_RPAD1]  (value not drawn)
TP9  TPSMDR1  [TP_RPAD1]  (value not drawn)
TP10  TPSMDR1  [TP_RPAD1]  (value not drawn)
TP11  TPSMDR1  [TP_RPAD1]  (value not drawn)
TP12  TPSMDR1  [TP_RPAD1]  (value not drawn)
TP13  TPSMDR1  [TP_RPAD1]  (value not drawn)
TP14  TPSMDR1  [TP_RPAD1]  (value not drawn)
TP15  TPSMDR1  [TP_RPAD1]  (value not drawn)
TP16  TPSMDR1  [TP_RPAD1]  (value not drawn)
TP17  TPSMDR1  [TP_RPAD1]  (value not drawn)
TP18  TPSMDR1  [TP_RPAD1]  (value not drawn)
U3[1]  NT3H2111W0FHKH  [SO8_SOIC127P600X175-8N]  (value not drawn)
U3[2]  NT3H2111W0FHKH  [XQFN-8]
U4  BMA400  [BMA400]
U5  MAX1759  [UMAX10]

### Nets
GND: BATT1.2(NEG) BATT2.2(NEG) C21[1].1 C21[2].1 C22[1].1 C22[2].1 C23.1 C24[1].1 C24[2].1 C25[1].1 C25[2].1 C26.1 C27.1 C28.1 C29.1 C32.1 C33.1 C35[1].2 C35[2].2 C36[1].2 C36[2].2 C37[1].2 C37[2].2 C38[1].2 C38[2].2 C39[1].2 C39[2].2 C40[1].2 C40[2].2 C41[1].2 C41[2].2 C43[1].2 C43[2].2 D2.A D5[1].C D5[2].C J7.1 J12.8 J12.17 J13.1 R27.1 R28.1 R29.1 R32.1 R38.1 R39.1 R41.2 T3.S T4.S T5.S U3[1].2(VSS) U3[2].2(VSS) U4.8(GNDIO) U4.9(GND) U5.5(GND) U5.6(PGND)
VBAT: BATT1.1(POS) BATT2.1(POS) J10.1
VBOOST_LED: C33.2 J8.1 R22.2 R40.2 U5.9(OUT)
Vcc: C21[1].2 C21[2].2 C22[1].2 C22[2].2 C23.2 C24[1].2 C24[2].2 C25[1].2 C25[2].2 D2.C J4.2 J5.1 J6.1 J8.3 J10.2 R23.2 R30.2 R33.2 R35.2 R36.2
VDD_LED: D1.4(ANODE) J8.2 R22.1 R23.1
VEXT: J7.2 J10.3
BMA_INT: U4.5(INT1) ; off-sheet BMA_INT
BMA_SCL: U4.12(SCX) ; off-sheet BMA_SCL
BMA_SDA: U4.2(SDX) ; off-sheet BMA_SDA
EPD_BUSYn: J12.9 TP13.P$1 ; off-sheet EPD_BUSYn
EPD_CSn: J12.12 TP16.P$1 ; off-sheet EPD_CSn
EPD_DC: J12.11 TP15.P$1 ; off-sheet EPD_DC
EPD_MOSI: J12.14 TP18.P$1 ; off-sheet EPD_MOSI
EPD_RESETn: J12.10 TP14.P$1 ; off-sheet EPD_RESETn
EPD_SCLK: J12.13 TP17.P$1 ; off-sheet EPD_SCLK
EPD_VCC: C36[1].1 C36[2].1 J12.15 J12.16 L4[1].1 L4[2].1 L4[3].1 L4[4].1 TP11.P$1 ; off-sheet EPD_VCC
FIELD_DETECT: U3[1].4(FD) U3[2].4(FD) ; off-sheet FIELD_DETECT
I2C_SCL: J13.5 ; off-sheet I2C_SCL
I2C_SDA: J13.6 ; off-sheet I2C_SDA
LED_B: R28.2 T5.G ; off-sheet LED_B
LED_BST_EN: R37.1 R38.2 U5.2(~{SHDN}) ; off-sheet LED_BST_EN
LED_G_DBG_UART_RX: R27.2 T4.G ; off-sheet LED_G_DBG_UART_RX
LED_R_DBG_UART_TX: R29.2 T3.G ; off-sheet LED_R_DBG_UART_TX
NFC-FDn_XL-INT1: J13.2 ; off-sheet NFC-FDn_XL-INT1
NFC_SCL: U3[1].3(SCL) U3[2].3(SCL) ; off-sheet NFC_SCL
NFC_SDA: U3[1].5(SDA) U3[2].5(SDA) ; off-sheet NFC_SDA
RESET_TOUCHn: J13.3 ; off-sheet RESET_TOUCHn
NetC26_2: C26.2 C27.2 J5.2 R30.1 R31.1 U4.3(VDDIO) U4.7(VDD) U4.10(~{CS})
NetC28_2: C28.2 J4.1 R33.1 U3[1].6(VCC) U3[2].6(VCC)
NetC29_2: C29.2 TP8.P$1 U3[1].7(VOUT) U3[2].7(VOUT)
NetC30_1: C30.1 C31.1 NFC_ANT.PB R34.1 U3[1].8(LB) U3[2].8(LB)
NetC30_2: C30.2 C31.2 NFC_ANT.PA R34.2 U3[1].1(LA) U3[2].1(LA)
NetC32_2: C32.2 J6.2 R36.1 R37.2 U5.3(IN) U5.4(IN)
NetC34_1: C34.1 U5.7(CXN)
NetC34_2: C34.2 U5.8(CXP)
NetC35[1]_1: C35[1].1 C35[2].1 J12.5
NetC37[1]_1: C37[1].1 C37[2].1 J12.18
NetC38[1]_1: C38[1].1 C38[2].1 J12.20
NetC39[1]_1: C39[1].1 C39[2].1 J12.22
NetC40[1]_1: C40[1].1 C40[2].1 J12.24
NetC41[1]_1: C41[1].1 C41[2].1 D3[1].C D3[2].C J12.21 TP10.P$1
NetC42[1]_1: C42[1].1 C42[2].1 D4[1].C D4[2].C D5[1].A D5[2].A
NetC42[1]_2: C42[1].2 C42[2].2 D3[1].A D3[2].A L4[1].2 L4[2].2 L4[3].2 L4[4].2 T2.D
NetC43[1]_1: C43[1].1 C43[2].1 D4[1].A D4[2].A J12.23 TP9.P$1
NetD1_1: D1.1(RED) R26.2 TP7.P$1
NetD1_2: D1.2(GREEN) R24.2 TP5.P$1
NetD1_3: D1.3(BLUE) R25.2 TP6.P$1
NetJ12_2: J12.2 T2.G TP12.P$1
NetJ12_3: J12.3 R41.1 T2.S
NetJ13_4: J13.4 R35.1
NetR24_1: R24.1 T4.D
NetR25_1: R25.1 T5.D
NetR26_1: R26.1 T3.D
NetR31_2: R31.2 R32.2 U4.1(SDO)
NetR39_2: R39.2 R40.1 U5.10(FB)

Not connected (* = marked no-connect by the designer): J12 1* 4* 6* 7* 19*; M1 0; M2 0; M3 0; M4 0; U4 4(NC)* 6(INT2)* 11(NC)*; U5 1(POK)*

### Notes on the sheet
- Battery circuit
- LED circuit
- Triaxial accelerometer
- NFC NTAG
- EPD driving circuit
- LED Boost
- Touch Interface
- Mechanical Fix
- Title
- Size:
- Date:
- A3
- Number:
- Time:
- Revision:
- Sheet
- of
- File:

### Library data of the parts
BATT1 BATT2 = 1052TR: Battery Holder _Open_ Coin, 24.5mm 1 Cell SMD _SMT_ Tab; MF: Keystone Electronics; Availability: Unavailable; SnapEDA_Link: https://www.snapeda.com/parts/1052TR/Keystone%20Electronics/view-part/3611881/?ref=snap; MP: 1052TR; Price: None; Package: None; Value: *
C21[1] C22[1] = CMP-1662-00011-2: Chip Capacitor, 100 uF, +/- 20%, 6.3 V, -55 to 85 degC, 1206 (3216 Metric), RoHS, Tape and Reel; PartNumber: GRM31CR60J107ME39L; Capacitance: 100 uF; Voltage Rating (DC): 6.3 V; Type (Capacitors): X5R; REACH SVHC: No SVHC; Height: 1.6 mm; Tolerance: 20%; Packaging: Tape and Reel; Mount: Surface Mount; PackageDescription: 2-Pin Surface Mount Device, Body 3.2 x 1.6 mm; ComponentLink1URL: http://www.murata.com/; Case\/Package: 1206; Pins: 2; ComponentLink2Description: Datasheet; PackageReference: 1206; Width: 1.6 mm; Package Quantity: 2000; Min Operating Temperature: -55 degC; Case Code (Imperial): 1206; Max Operating Temperature: 85 degC; DatasheetVersion: 09/2016; Mounting Technology: Surface Mount; Voltage Rating: 6.3 V; ComponentLink1Description: Manufacturer URL; Radiation Hardening: No; Case Code (Metric): 3216; Length: 3.2 mm; ComponentLink2URL: http://psearch.en.murata.com/capacitor/product/GRM31CR60J107ME39%23.pdf; RoHSCompliant: true
C21[2] C22[2] = CMP-1662-00011-2: Chip Capacitor, 100 uF, +/- 20%, 6.3 V, -55 to 85 degC, 1206 (3216 Metric), RoHS, Tape and Reel; PartNumber: GRM31CR60J107ME39L; Case\/Package: 1206; Capacitance: 100 uF; Voltage Rating (DC): 6.3 V; Type (Capacitors): X5R; REACH SVHC: No SVHC; Height: 1.6 mm; Tolerance: 20%; Packaging: Tape and Reel; Mount: Surface Mount; PackageDescription: 2-Pin Surface Mount Device, Body 3.2 x 1.6 mm; ComponentLink1URL: http://www.murata.com/; Pins: 2; ComponentLink2Description: Datasheet; PackageReference: 1206; Width: 1.6 mm; Package Quantity: 2000; Min Operating Temperature: -55 degC; Case Code (Imperial): 1206; Max Operating Temperature: 85 degC; DatasheetVersion: 09/2016; Mounting Technology: Surface Mount; Voltage Rating: 6.3 V; ComponentLink1Description: Manufacturer URL; Radiation Hardening: No; Case Code (Metric): 3216; Length: 3.2 mm; ComponentLink2URL: http://psearch.en.murata.com/capacitor/product/GRM31CR60J107ME39%23.pdf; RoHSCompliant: true
C23 C26 C27 = CMP-2008-03712-2: Ceramic Capacitor for Automotive 100nF ±10% 16VDC X7R 0402 Paper T/R; Voltage Rating: 16V; Height: 0.5mm; Width: 0.5mm; Packaging: Tape and Reel; Case Code (Imperial): 0402; Package Quantity: 1; Radiation Hardening: No; Voltage Rating (DC): 16V; Capacitance: 100nF; Tolerance: 10%; Thickness: 0.022inch; Max Operating Temperature: 125°C; Depth: 0.5mm; Ratings: AEC-Q200; Termination: SMD/SMT; Case Code (Metric): 1005; Min Operating Temperature: -55°C; Dielectric: X7R; Length: 1mm; Case/Package: 0402; Lead Free: Lead Free; Mount: Surface Mount
C24[1] C24[2] C25[1] C25[2] = CMP-06035-063005-1: CAP CER 100UF 6.3V X5R 1206; Tolerance: 20%; Case Code (Metric): 3216; Width: 0.063inch; Packaging: Tape and Reel; Lead Free: Lead Free; Capacitance: 100uF; Package Quantity: 1; Construction: Flat; Max Operating Temperature: 85°C; Voltage Rating (DC): 6.3V; Min Operating Temperature: -55°C; Case Code (Imperial): 1206; RoHS Compliant: Yes; Voltage: 6.3V; Mount: Surface Mount; Thickness: 0.071inch; Height: 1.6mm; Series: GRM; REACH SVHC: No SVHC; Length: 3.2mm; Voltage Rating: 6.3V; Radiation Hardening: No; Dielectric: X5R; Case/Package: 1206; Depth: 1.6mm; Termination: SMD/SMT
C28 = CMP-2010-01264-2: Chip Multilayer Ceramic Capacitors for General Purpose, 0201, 0.10uF, X5R, 15%, 10%, 10V; Mount: Surface Mount; Dielectric: X5R; Width: 0.012inch; Tolerance: 10%; Radiation Hardening: No; Voltage Rating: 10V; REACH SVHC: No SVHC; Height: 0.3mm; Max Operating Temperature: 85°C; Voltage Rating (DC): 10V; Capacitance: 100nF; Thickness: 0.013inch; Termination: SMD/SMT; Lead Free: Lead Free; Package Quantity: 1; Case/Package: 0201; Min Operating Temperature: -55°C; Weight: 6E-06oz; Length: 0.6mm; Case Code (Imperial): 0201; Depth: 0.3mm; Voltage: 10V; Packaging: Tape and Reel; Case Code (Metric): 0603
C29 = CMP-120-00038-A.01: SubCategory Tag: Ceramic; Min Operating Temp: -55°C; RoHS: Compliant; Mount: SMD; Rating: 10V; Tolerance: 10%; Package: 0201; Material: X7R; Max Operating Temp: 125°C
C30 = CMP-2010-01602-2: Chip Multilayer Ceramic Capacitors for General Purpose, 0201, 7.5pF, C0G, 30ppm/°C, 0.1pF, 50V; Mount: Surface Mount; Case/Package: 0201; Case Code (Imperial): 0201; Min Operating Temperature: -55°C; Packaging: Tape and Reel; Package Quantity: 15000; Termination: SMD/SMT; Height: 0.3mm; Width: 0.012inch; Length: 0.024inch; Voltage Rating (DC): 50V; Max Operating Temperature: 125°C; Voltage Rating: 50V; Dielectric: C0G; Capacitance: 7.5pF; Case Code (Metric): 0603; Thickness: 0.013inch
C31 = CMP-120-00031-A.02: SubCategory Tag: Ceramic; Min Operating Temp: -55°C; Package: 0201; Mount: SMD; Max Operating Temp: 125°C; Rating: 50V; RoHS: Compliant; Material: C0G; Tolerance: 0.05pF
C32 C33 = CMP-2006-02520-2: Chip Multilayer Ceramic Capacitors for General Purpose, 0603, 10uF, X5R, 15%, 20%, 25V; Tolerance: 20%; Resistor Type: Ceramic; Voltage: 25V; Max Operating Temperature: 85°C; Min Operating Temperature: -55°C; Capacitance: 10uF; Dielectric: X5R; Lead Free: Lead Free; REACH SVHC: No SVHC; Case/Package: 0603; Mount: Surface Mount; Voltage Rating (DC): 25V; Height: 0.8mm; Length: 1.6mm; Thickness: 0.031inch; Width: 0.031inch; Termination: SMD/SMT; Case Code (Imperial): 0603; Case Code (Metric): 1608; Package Quantity: 1; Packaging: Tape and Reel; Depth: 0.8mm; Voltage Rating: 25V; Weight: 0.000222oz; Number of Pins: 2
C34 = CMP-2006-02359-2: Ceramic Capacitor for Automotive 330nF  ±10% 16VDC X7R 0603 Paper T/R; Voltage Rating (DC): 16V; Package Quantity: 1; Case Code (Metric): 1608; Height: 0.8mm; Min Operating Temperature: -55°C; Length: 1.6mm; Case Code (Imperial): 0603; Max Operating Temperature: 125°C; Thickness: 0.035inch; Dielectric: X7R; Voltage Rating: 16V; Tolerance: 10%; Lead Free: Lead Free; Mount: Surface Mount; Depth: 0.8mm; Width: 0.031inch; Ratings: AEC-Q200; Packaging: Tape and Reel; Case/Package: 0603; Radiation Hardening: No; Capacitance: 330nF; Termination: SMD/SMT
C35[1] C35[2] C37[1] C37[2] C38[1] C38[2] C39[1] C39[2] C40[1] C40[2] = CMP-2006-02363-3: Ceramic Capacitor for Automotive 1uF  ±10% 25VDC X7R 0603 Paper T/R; Voltage Rating: 25V; Min Operating Temperature: -55°C; Ratings: AEC-Q200; Case Code (Imperial): 0603; Length: 1.6mm; REACH SVHC: No SVHC; Mount: Surface Mount; Width: 0.031inch; Package Quantity: 4000; Radiation Hardening: No; Lead Free: Lead Free; Dielectric: X7R; Thickness: 0.035inch; Weight: 0.000222oz; Tolerance: 10%; Case Code (Metric): 1608; Voltage Rating (DC): 25V; Case/Package: 0603; Voltage: 25V; Max Operating Temperature: 125°C; Termination: SMD/SMT; Depth: 0.8mm; Height: 0.8mm; Packaging: Tape and Reel; Capacitance: 1uF
C36[1] C36[2] C41[1] C41[2] C42[1] C42[2] C43[1] C43[2] = CMP-2000-05448-2: CAP CER 10UF 10V X5R 0603; Manufacturer Part Number: GRM188R61A106KE69D; Manufacturer: Murata; Temperature Coefficient: 15%; Material: Ceramic; Tolerance: 10%; Device Class L1: Passive Components; ComponentLink2Description: Datasheet; Height: 0.95mm; Package: GRM18-0.15; Octopart: https://octopart.com/grm188r61a106ke69d-murata-22851381; Value: 10uF; Digikey Description: CAP CER 10UF 10V X5R 0603; Temperature Range High: +85°C; Temperature Range Low: -55°C; Temperature Characteristic: X5R; Capacitance: 10uF; RoHS: TRUE; Device Class L2: Capacitors; ComponentLink2URL: https://search.murata.co.jp/Ceramy/image/img/A01X/G101/ENG/GRM188R61A106KE69-01A.pdf; Device Class L3: Ceramic Capacitors; Lead Free: Yes; Mouser Description: Multilayer Ceramic Capacitors MLCC - SMD/SMT 0603 10uF 10volts X5R + - 10%; Category: Cap; Voltage Rating: 10V; Temperature: -55°C to +85°C; Automotive: No
D1 = ASCB-JTC2-0A308: Standard LEDs - SMD 1615 Tricolor PLCC-4 LED; Manufacturer_Name: Avago Technologies; Geometry.Height: 1.2mm; Mouser Part Number: 630-ASCB-JTC2-0A308; Mouser Price/Stock: https://www.mouser.co.uk/ProductDetail/Broadcom-Avago/ASCB-JTC2-0A308?qs=TuK3vfAjtkWp7J8ieqn2Tw%3D%3D; Manufacturer_Part_Number: ASCB-JTC2-0A308; Datasheet Link: https://docs.broadcom.com/doc/ASCB-JTC2-0A308-1615-Tricolor-PLCC-4-LED-DS
D2 = ESD7551N2T5G: ESD Suppressors / TVS Diodes BI-DIRECTIONAL 5V ESD PR; Manufacturer_Name: onsemi; Geometry.Height: 0.4mm; Manufacturer_Part_Number: ESD7551N2T5G; Mouser Part Number: 863-ESD7551N2T5G; Mouser Price/Stock: https://www.mouser.co.uk/ProductDetail/onsemi/ESD7551N2T5G?qs=5aG0NVq1C4x8NutXGbtG6w%3D%3D; Arrow Part Number: ESD7551N2T5G; Arrow Price/Stock: https://www.arrow.com/en/products/esd7551n2t5g/on-semiconductor; Mouser Testing Part Number: *; Mouser Testing Price/Stock: *; Datasheet Link: http://www.onsemi.com/pub/Collateral/ESD7551-D.PDF
D3[1] D3[2] D4[1] D4[2] D5[1] D5[2] = PMEG3005ELD_315: Schottky Diodes & Rectifiers Schottky Diode; Manufacturer_Name: Nexperia; Manufacturer_Part_Number: PMEG3005ELD,315; Geometry.Height: 0.4mm; Mouser Part Number: 771-PMEG3005ELD315; Mouser Price/Stock: https://www.mouser.co.uk/ProductDetail/Nexperia/PMEG3005ELD315?qs=j56XEm5BXrSQr1dGtOQTNA%3D%3D; Arrow Part Number: PMEG3005ELD,315; Arrow Price/Stock: https://www.arrow.com/en/products/pmeg3005eld315/nexperia?region=nac; Mouser Testing Part Number: *; Mouser Testing Price/Stock: *; Datasheet Link: https://assets.nexperia.com/documents/data-sheet/PMEG3005ELD.pdf
J4-J7 = HTSW-102-28-F-S: as J2 on sheet EFR32xG22_ESL-Node_Ref-Des_Sheet1; Package: None; Price: None; Purchase-URL: https://pricing.snapeda.com/search/part/HTSW10228FS/?ref=eda; Availability: In Stock; Value: *; Check_prices: https://www.snapeda.com/parts/HTSW10228FS/Samtec/view-part/?ref=eda; SnapEDA_Link: https://www.snapeda.com/parts/HTSW10228FS/Samtec/view-part/?ref=snap
J8 J10 = 75160-101-03LF: BergStikÂ®, Board to Board connector, Unshrouded vertical header, through hole, single Row,3 position, 2.54mm pitch; MF: Amphenol ICC (FCI); SnapEDA_Link: https://www.snapeda.com/parts/75160-101-03LF/Amphenol+FCI/view-part/?ref=snap; Availability: In Stock; Purchase-URL: https://pricing.snapeda.com/search/part/75160-101-03LF/?ref=eda; Check_prices: https://www.snapeda.com/parts/75160-101-03LF/Amphenol+FCI/view-part/?ref=eda; Value: *; Package: None; MP: 75160-101-03LF; Price: None
J12 = CMP-11609-000022-1: CONN FPC/FFC 24POS .5MM; Number of Positions: 24; Actuator Material: Nylon; Voltage Rating: 50V; Pitch: 0.02inch; Current Rating: 500mA; Contact Plating: Gold; Packaging: Tape and Reel; RoHS Compliant: Yes; Contact Material: Bronze; Min Operating Temperature: -55°C; Max Operating Temperature: 85°C; Number of Pins: 24; Housing Material: Polymer; Termination: Solder; Mount: Surface Mount; Flammability Rating: UL94 V-0
J13 = FH34SRJ-6S-0.5SH(50): Price: None; Package: None; Availability: Unavailable; MP: FH34SRJ-6S-0.5SH(50); Value: *
L4[1] L4[2] L4[3] L4[4] = CMP-14484-000285-1: SMD Inductors 10uH ±10% 0.52A 0.65Ω 0806; Current Rating: 520mA; Test Frequency: 2.52MHz; Shielding: Unshielded; Saturation Current: 250mA; Self Resonant Frequency: 32MHz; Core Material: Ferrite; DC Resistance (DCR): 650mR; Series: CB; RoHS Compliant: Yes; Termination: SMD/SMT; Package Quantity: 2000; Radiation Hardening: No; Min Operating Temperature: -40°C; Length: 0.079inch; Tolerance: 10%; Case/Package: 0806; Packaging: Tape and Reel; Max DC Current: 520mA; Inductance Tolerance: 10%; Case Code (Imperial): 0806; Height: 1.6mm; Halogen Free: Halogen Free; Inductance: 10uH; Lead Free: Lead Free; Height - Seated (Max): 0.071inch; Case Code (Metric): 2016; Width: 1.6mm; Depth: 1.8mm; Number of Pins: 2; Resistor Type: Wirewound; Max Operating Temperature: 105°C; Mount: Surface Mount
M1-M4 = HOLE_2.2_NPL: Not Mounted: NM
NFC_ANT = NFC_ANTENNA_custom: Custom NFC Printed Antenna
R22 R23 R30 R33 R35-R38 = CMP-1012-00001-2: as R1 on sheet EFR32xG22_ESL-Node_Ref-Des_Sheet1
R24 R25 = CMP-180-00121-A.01: as R5 on sheet EFR32xG22_ESL-Node_Ref-Des_Sheet1; Package: 0201; Mount: SMD; Min Operating Temp: -55°C; Max Operating Temp: 155°C; RoHS: Compliant; Tolerance: 1%
R26 = CMP-1010-00059-1: 240R 0.05W 5% 0201 (0603 Metric)  SMD; Value: 240.00 Ohm; Case-Metric: 0603; Technology: SMT; Tolerance: 5 %; Case-EIA: 0201; Power: 0.05 W
R27-R29 = CMP-1010-00642-1: as R20 on sheet EFR32xG22_ESL-Node_Ref-Des_Sheet1; Technology: SMT; Power: 0.05 W; Case-EIA: 0201; Tolerance: 1 %
R31 R32 R34 R39 R40 = CMP-180-00011-A.05: SubCategory Tag: Thick Film; Rating: 50mW; Tolerance: 0%; Package: 0201; Mount: SMD; Min Operating Temp: -55°C; RoHS: Compliant; Max Operating Temp: 85°C
R41 = CMP-2002-01737-1: Part Number: RL0510S-R47-F; Manufacturer: Susumu
T2 = PMCB60XNZ: MOSFET PMCB60XN - 30 V, N-channel Trench MOSFET; Manufacturer_Name: Nexperia; Geometry.Height: 0.22mm; Mouser Part Number: 771-PMCB60XNZ; Mouser Price/Stock: https://www.mouser.co.uk/ProductDetail/Nexperia/PMCB60XNZ?qs=e8oIoAS2J1TgcVzaOfoXQA%3D%3D; Manufacturer_Part_Number: PMCB60XNZ; Datasheet Link: https://assets.nexperia.com/documents/data-sheet/PMCB60XN.pdf
T3-T5 = PMZB290UNE: N-Channel 20V 1.2A (Ta) 350mW (Ta), 5.43W (Tc) Surface Mount DFN1006B-3; MF: NXP Semiconductors; Package: None; Availability: Unavailable; SnapEDA_Link: https://www.snapeda.com/parts/PMZB290UNE/NXP%20Semiconductors/view-part/563526/?ref=snap; MP: PMZB290UNE; Value: *; Price: None
TP5-TP18 = TPSMDR1: Testpoint
U3[1] U3[2] = CMP-10079-000001-1: IC RFID TRANSP 13.56MHZ 8XQFN; Manufacturer: NXP; Max Junction Temp: +105°C; Standoff Height: 0mm; Temperature Range Low: -40°C; Package: SOT902-3; Ambient Temperature Range High: +105°C; Height: 0.5mm; Digikey Description: IC RFID TRANSP 13.56MHZ 8XQFN; ComponentLink2URL: https://www.nxp.com/docs/en/data-sheet/NT3H2111_2211.pdf; ComponentLink2Description: Datasheet; Footprint Url: https://www.nxp.com/docs/en/package-information/SOT902-3.pdf; RoHS: TRUE; Automotive: No; Category: IC; Temperature Range High: +105°C; Octopart: https://octopart.com/nt3h2111w0fhkh-nxp+semiconductors-71112033; Device Class L2: unset; Lead Free: Yes; Device Class L3: unset; Temperature: -40°C to +105°C; Ambient Temperature Range Low: -40°C; Mouser Description: NFC/RFID Tag and Transponder IC 13560kHz 1KByte 8-Pin XQFN EP T/R; Device Class L1: Integrated Circuits (ICs); Manufacturer Part Number: NT3H2111W0FHKH
U4 = CMP-191065-000001-1: ACCELEROMETER 2-16G 12LGA; Manufacturer: Bosch Sensortec; Accel Resolution: 12bits; Accel Range: 2/4/8/16g; Accel Sensitivity: 128/256/512/1024LSB/g; Min Supply Voltage: 1.2V; Operating Supply Current: 14.5uA; Accel Axis: X+Y and Z; Sensor Output: I2C,SPI; Max Supply Voltage: 3.6V; Lead Free: Yes; Manufacturer Part Number: BMA400; Ambient Temperature Range High: +85°C; Package: 0; RoHS: TRUE; Device Class L3: Accelerometers; Temperature Range High: +85°C; ComponentLink2URL: https://ae-bst.resource.bosch.com/media/_tech/media/datasheets/BST-BMA400-DS000.pdf; Octopart: https://octopart.com/bma400-bosch+sensortec-106101410; Temperature: -40°C to +85°C; Ambient Temperature Range Low: -40°C; Device Class L1: Sensors; Device Class L2: Motion Sensors; Mouser Description: BMA400 Series 3.6 V ±2g/4g/8g/16g 3 Axes Ultra Low Power Accelerometer - LGA-12; Height: 1mm; Automotive: No; Temperature Range Low: -40°C; ComponentLink2Description: Datasheet; Category: IC; Digikey Description: ACCELEROMETER 2-16G 12LGA
U5 = CMP-0246-00630-1: Buck/Boost Regulating Charge Pump, open-drain POK, 10-Pin uMAX, -40°C to +85°C, Pb-Free; PackageReference: U10+2; ComponentLink3URL: http://pdfserv.maxim-ic.com/package_dwgs/21-0061.PDF; PackageVersion: revL, 2008; Code_JEDEC: MO-187-BA; ComponentLink3Description: Package Specification; PackageDescription: 10-Pin Micro-MAX Thin Shrink Small Outline (uSOP), 3 x 3 x 0.85 mm Body, 0.5 mm Pitch, Pb-Free; ComponentLink2URL: http://datasheets.maxim-ic.com/en/ds/MAX1759.pdf; ComponentLink1Description: Manufacturer URL; ComponentLink2Description: Datasheet; DatasheetVersion: Rev 1, Jun-2000; ComponentLink1URL: http://www.maxim-ic.com

## Nets that join several sheets
GND: EFR32xG22_ESL-Node_Ref-Des_Sheet1 (36 pins), EFR32xG22_ESL-Node_Ref-Des_Sheet2 (56 pins)
Vcc: EFR32xG22_ESL-Node_Ref-Des_Sheet1 (17 pins), EFR32xG22_ESL-Node_Ref-Des_Sheet2 (20 pins)
BMA_INT: EFR32xG22_ESL-Node_Ref-Des_Sheet1 (R8.1), EFR32xG22_ESL-Node_Ref-Des_Sheet2 (U4.5)
BMA_SCL: EFR32xG22_ESL-Node_Ref-Des_Sheet1 (R11.2), EFR32xG22_ESL-Node_Ref-Des_Sheet2 (U4.12)
BMA_SDA: EFR32xG22_ESL-Node_Ref-Des_Sheet1 (R10.2), EFR32xG22_ESL-Node_Ref-Des_Sheet2 (U4.2)
EPD_BUSYn: EFR32xG22_ESL-Node_Ref-Des_Sheet1 (U1.6), EFR32xG22_ESL-Node_Ref-Des_Sheet2 (J12.9 TP13.P$1)
EPD_CSn: EFR32xG22_ESL-Node_Ref-Des_Sheet1 (U1.3), EFR32xG22_ESL-Node_Ref-Des_Sheet2 (J12.12 TP16.P$1)
EPD_DC: EFR32xG22_ESL-Node_Ref-Des_Sheet1 (U1.4), EFR32xG22_ESL-Node_Ref-Des_Sheet2 (J12.11 TP15.P$1)
EPD_MOSI: EFR32xG22_ESL-Node_Ref-Des_Sheet1 (U1.1), EFR32xG22_ESL-Node_Ref-Des_Sheet2 (J12.14 TP18.P$1)
EPD_RESETn: EFR32xG22_ESL-Node_Ref-Des_Sheet1 (U1.5), EFR32xG22_ESL-Node_Ref-Des_Sheet2 (J12.10 TP14.P$1)
EPD_SCLK: EFR32xG22_ESL-Node_Ref-Des_Sheet1 (U1.2), EFR32xG22_ESL-Node_Ref-Des_Sheet2 (J12.13 TP17.P$1)
EPD_VCC: EFR32xG22_ESL-Node_Ref-Des_Sheet1 (R21.2 T1.D), EFR32xG22_ESL-Node_Ref-Des_Sheet2 (9 pins)
FIELD_DETECT: EFR32xG22_ESL-Node_Ref-Des_Sheet1 (R7.2), EFR32xG22_ESL-Node_Ref-Des_Sheet2 (U3[1].4 U3[2].4)
I2C_SCL: EFR32xG22_ESL-Node_Ref-Des_Sheet1 (5 pins), EFR32xG22_ESL-Node_Ref-Des_Sheet2 (J13.5)
I2C_SDA: EFR32xG22_ESL-Node_Ref-Des_Sheet1 (5 pins), EFR32xG22_ESL-Node_Ref-Des_Sheet2 (J13.6)
LED_B: EFR32xG22_ESL-Node_Ref-Des_Sheet1 (U1.16), EFR32xG22_ESL-Node_Ref-Des_Sheet2 (R28.2 T5.G)
LED_BST_EN: EFR32xG22_ESL-Node_Ref-Des_Sheet1 (R3.1), EFR32xG22_ESL-Node_Ref-Des_Sheet2 (R37.1 R38.2 U5.2)
LED_G_DBG_UART_RX: EFR32xG22_ESL-Node_Ref-Des_Sheet1 (J1.4 U1.17), EFR32xG22_ESL-Node_Ref-Des_Sheet2 (R27.2 T4.G)
LED_R_DBG_UART_TX: EFR32xG22_ESL-Node_Ref-Des_Sheet1 (J1.5 U1.18), EFR32xG22_ESL-Node_Ref-Des_Sheet2 (R29.2 T3.G)
NFC-FDn_XL-INT1: EFR32xG22_ESL-Node_Ref-Des_Sheet1 (6 pins), EFR32xG22_ESL-Node_Ref-Des_Sheet2 (J13.2)
NFC_SCL: EFR32xG22_ESL-Node_Ref-Des_Sheet1 (R12.2), EFR32xG22_ESL-Node_Ref-Des_Sheet2 (U3[1].3 U3[2].3)
NFC_SDA: EFR32xG22_ESL-Node_Ref-Des_Sheet1 (R9.2), EFR32xG22_ESL-Node_Ref-Des_Sheet2 (U3[1].5 U3[2].5)
RESET_TOUCHn: EFR32xG22_ESL-Node_Ref-Des_Sheet1 (R4.2), EFR32xG22_ESL-Node_Ref-Des_Sheet2 (J13.3)